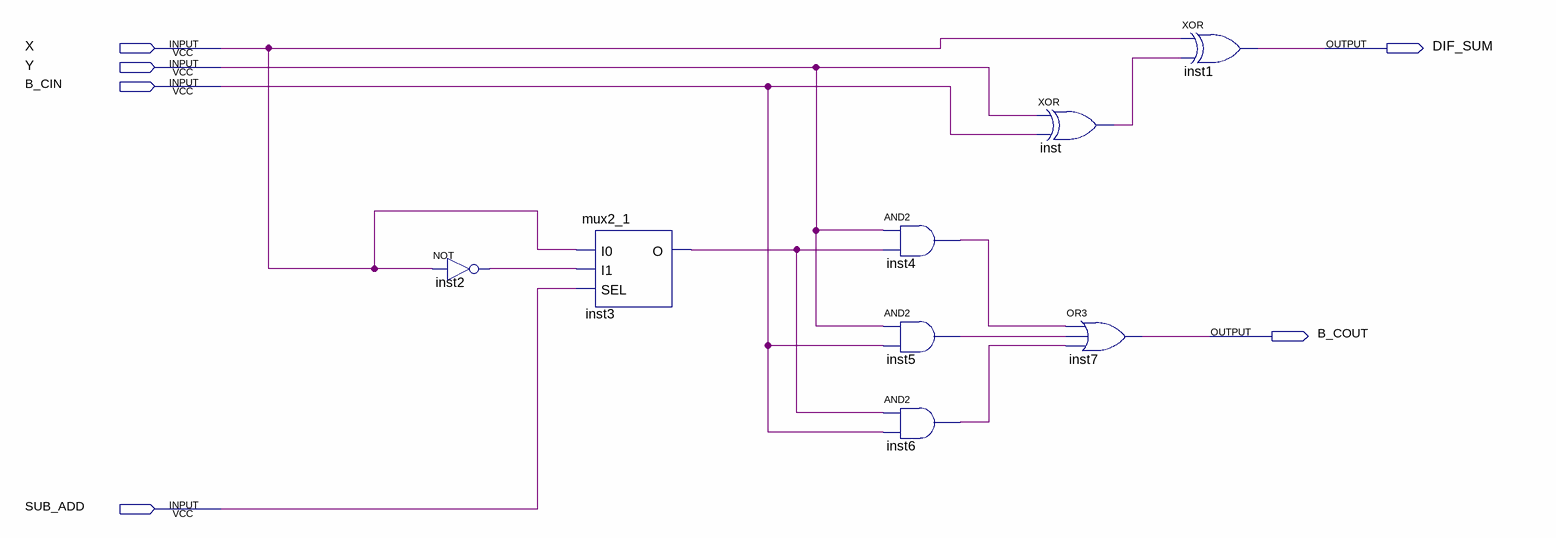
[diagram p0: schematic sheet]
// Quartus schematic fullSubAdd.bdf as structural Verilog: 8 symbols, 6 pins
module fullSubAdd (
  input  X,
  input  Y,
  input  B_CIN,
  input  SUB_ADD,
  output DIF_SUM,
  output B_COUT
);

  wire inst2_out, inst3_o, inst4_out, inst5_out, inst6_out, inst_out;

  not inst2 (inst2_out, X);
  mux2_1 inst3 (.I0(X), .I1(inst2_out), .SEL(SUB_ADD), .O(inst3_o));
  and inst4 (inst4_out, Y, inst3_o);
  and inst5 (inst5_out, Y, B_CIN);
  and inst6 (inst6_out, inst3_o, B_CIN);
  xor inst (inst_out, Y, B_CIN);
  or inst7 (B_COUT, inst4_out, inst5_out, inst6_out);
  xor inst1 (DIF_SUM, X, inst_out);
endmodule
